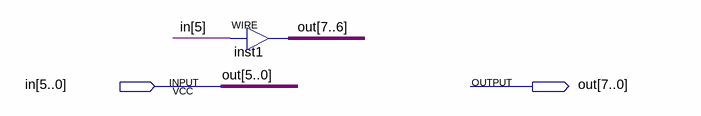
[diagram p0: schematic sheet]
// Quartus schematic sext6.bdf as structural Verilog: 1 symbols, 2 pins
module sext6 (
  input  [5:0] in,
  output [7:0] out
);

  assign out[7:6] = {2{in[5]}};  // WIRE inst1

  assign out[5:0] = in;
endmodule
